# Altium schematic sheet RVP_OVP_LC.SchDoc
size A
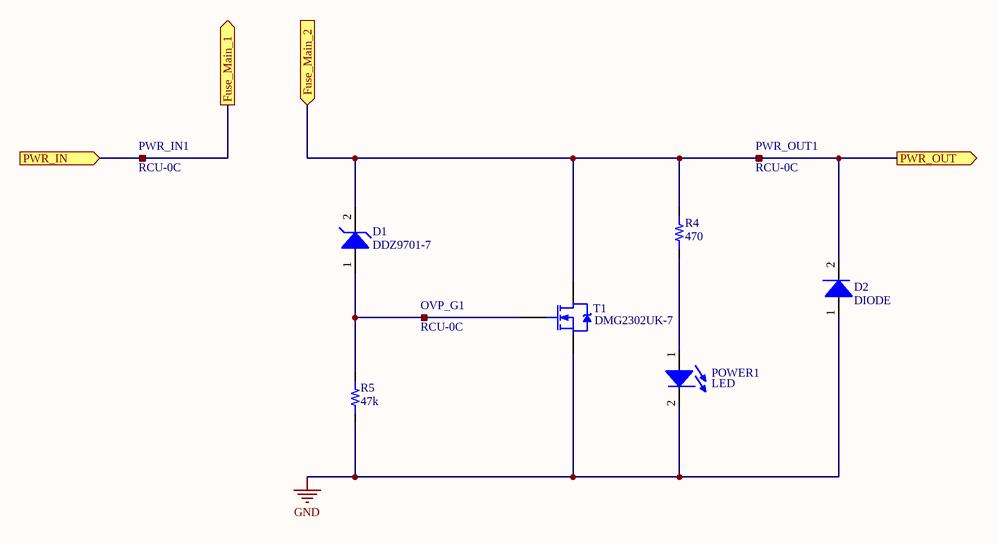
[diagram p0: RVP_OVP_LC.SchDoc]

## Parts
D1  DDZ9701-7  [SOD123F]
D2  DIODE  [SOD-128]
OVP_G1  RCU-0C  [RCU-0C]
POWER1  LED  [0805_LED]
PWR_IN1  RCU-0C  [RCU-0C]
PWR_OUT1  RCU-0C  [RCU-0C]
R4  value 470  [RES 0805/2012]  (hidden comment: Resistor 470 0805 1/10W 1%)
R5  value 47k  [RES 0805/2012]  (hidden comment: Resistor 47k 0805 1/10W 1%)
T1  DMG2302UK-7  [SOT23-3]

## Ports
Fuse_Main_1 (out), Fuse_Main_2 (in), PWR_IN (in), PWR_OUT (out)

## Nets
GND: D2.1(A) POWER1.2(K) R5.1 T1.2(S)
Fuse_Main_1: PWR_IN1.1 ; port PWR_IN, port Fuse_Main_1
Fuse_Main_2: D1.2(K) D2.2(K) PWR_OUT1.1 R4.2 T1.3(D) ; port PWR_OUT, port Fuse_Main_2
NetD1_1: D1.1(A) OVP_G1.1 R5.2 T1.1(G)
NetPOWER1_1: POWER1.1(A) R4.1

## Library data of the parts
D1 = 10: Zener Diode 14V 500mW ±5% Surface Mount SOD-123; Manufacturer_id: 8; idDiode: 10; Drawer_id: 1; Value: 14Vz; MfrPartNo: DDZ9701-7; Name: DDZ9701; Type: Zener; Num_Circuits: 1; Power: 500mW; Package: SOD-123; Link: https://www.digikey.com/product-detail/en/diodes-incorporated/DDZ9701-7/DDZ9701-7DICT-ND/3877402; ComponentLink1Description: Datasheet; ComponentLink1URL: https://www.diodes.com/assets/Datasheets/ds30410.pdf; Supplier1: Digi-Key; Supplier1PartNo: DDZ9701-7DICT-ND
D2 = 12: DIODE SCHOTTKY 30V 5A TMINIP2; Manufacturer_id: 1; idDiode: 12; Name: DB2431200L; Drawer_id: 1; Value: 5A; Type: Schottky; Num_Circuits: 1; Ic: 5A; Power: 30V; Package: SOD-128; MfrPartNo: DB2431200L; Link: https://www.digikey.com/product-detail/en/panasonic-electronic-components/DB2431200L/DB2431200LCT-ND/3884430; ComponentLink1Description: Datasheet; ComponentLink1URL: https://industrial.panasonic.com/content/data/SC/ds/ds4/DB2431200L_E.pdf; Supplier1: Digi-Key; Supplier1PartNo: DB2431200LCT-ND
OVP_G1 PWR_IN1 PWR_OUT1 = 5: Manufacturer_id: 1; idTable: 5; Name: RCU-0C_Test_Point; Drawer_id: 1; Package: 0603; MfrPartNo: RCU-0C; Link: https://www.digikey.com/product-detail/en/te-connectivity-amp-connectors/RCU-0C/A106145CT-ND/3477802; ComponentLink1Description: Datasheet; ComponentLink1URL: https://www.te.com/commerce/DocumentDelivery/DDEController?Action=srchrtrv&DocNm=1773266&DocType=DS&DocLang=English
POWER1 = 2: Manufacturer_id: 1; idLED: 2; Name: CMD17_0805_GREEN; Value: Green; Brightness: 7mcd; Id: 20mA; Vf: 2.1V; Drawer_id: 1; Package: 0805; Link: https://www.digikey.com/product-detail/en/visual-communications-company-vcc/CMD17-21VGD-TR8/L62505CT-ND/254936
R4 = 497: Manufacturer_id: 1; idResistor: 497; Name: Res_470_0805_1/10W_1%; Created_By: Nick Mah; Supplier 1: Digi-Key; Drawer_id: 1; Tolerance: 1%; Power: 1/10W; Package: 0805; ComponentLink1Description: Datasheet; Created_Date: 2018-10-20
R5 = 545: Manufacturer_id: 1; idResistor: 545; Name: Res_47k_0805_1/10W_1%; Created_By: Nick Mah; Supplier 1: Digi-Key; Drawer_id: 1; Tolerance: 1%; Power: 1/10W; Package: 0805; ComponentLink1Description: Datasheet; Created_Date: 2018-10-20
T1 = 6: MOSFET N-CHANNEL 30V 5A SOT23; Manufacturer_id: 1; idFETs: 6; Value: N_Channel; Vdss: 20V; Id: 2.8A; Rds_On: 90mOhm; Vgs(typ): 800mV; Vgs(Max): 1V; Created_By: Angel; Drawer_id: 1; Name: DMG2302UK-7; Num_Circuits: 1; Package: SOT-23; MfrPartNo: DMG2302UK-7; Link: https://www.digikey.com/product-detail/en/diodes-incorporated/DMG2302UK-7/DMG2302UK-7DICT-ND/6010163; Supplier1: Digi-Key